# Altium schematic sheet Thermal Camera.SchDoc: Thermal
size A4; SheetSize: A4
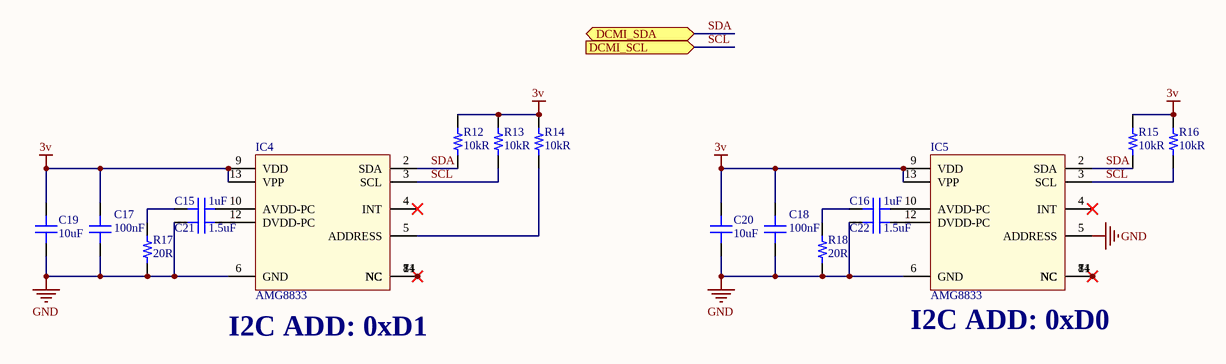
[diagram p0: Thermal Camera.SchDoc]

## Parts
C15  1uF  [CAP 0603/1608]
C16  1uF  [CAP 0603/1608]
C17  100nF  [CAP 0603/1608]
C18  100nF  [CAP 0603/1608]
C19  10uF  [CAP 0603/1608]
C20  10uF  [CAP 0603/1608]
C21  1.5uF  [CAP 0603/1608]
C22  1.5uF  [CAP 0603/1608]
IC4  AMG8833  [PANASONIC AMG8853]
IC5  AMG8833  [PANASONIC AMG8853]
R12  10kR  [RES 0603/1608]
R13  10kR  [RES 0603/1608]
R14  10kR  [RES 0603/1608]
R15  10kR  [RES 0603/1608]
R16  10kR  [RES 0603/1608]
R17  20R  [RES 0603/1608]
R18  20R  [RES 0603/1608]

## Ports
DCMI_SCL (in), DCMI_SDA (bidir)

## Nets
3v: C17.1 C18.1 C19.2 C20.2 IC4.9(VDD) IC4.13(VPP) IC5.9(VDD) IC5.13(VPP) R12.2 R13.2 R14.2 R15.2 R16.2
GND: C17.2 C18.2 C19.1 C20.1 C21.2 C22.2 IC4.6(GND) IC5.5(ADDRESS) IC5.6(GND) R17.1 R18.1
SCL: IC4.3(SCL) IC5.3(SCL) R13.1 R16.1 ; port DCMI_SCL
SDA: IC4.2(SDA) IC5.2(SDA) R12.1 R15.1 ; port DCMI_SDA
NetC15_1: C15.1 R17.2
NetC15_2: C15.2 IC4.10(AVDD-PC)
NetC16_1: C16.1 R18.2
NetC16_2: C16.2 IC5.10(AVDD-PC)
NetC21_1: C21.1 IC4.12(DVDD-PC)
NetC22_1: C22.1 IC5.12(DVDD-PC)
NetIC4_1: IC4.1(NC) IC4.7(NC) IC4.8(NC) IC4.11(NC) IC4.14(NC)
NetIC4_5: IC4.5(ADDRESS) R14.1
NetIC5_1: IC5.1(NC) IC5.7(NC) IC5.8(NC) IC5.11(NC) IC5.14(NC)

Not connected (* = marked no-connect by the designer): IC4 4(INT)*; IC5 4(INT)*

## Notes on the sheet
- (near IC4) I2C ADD: 0xD1
- (near IC5) I2C ADD: 0xD0
- Title:
- Size:
- Project:
- Revision:
- Sheet
- of
- Date:
- YıLDıZ IoT
- Elperek Mahallesi
- Saray Sokak, No:12
- SAKARYA / TURKEY
- File:

## Library data of the parts
C15 C16 = Capacitor - Ceramic: Ceramic, SMT Capacitor; Manufacturer: Samsung; Manufacturer Part Number: CL10A105KP8NNNC; Tolerance: 10%; Voltage Rating: 10V; Dielectric: X5R; Supplier 1: Digi-Key; Supplier Part Number 1: 1276-1182-1-ND; Stock 1: 4590831; Pricing 1: 1 = 0,10000, 10 = 0,03800, 100 = 0,01680, 500 = 0,01200, 1000 = 0,00943 (USD); RoHS: Yes; Mount: Surface Mount; Case/Package: 0603; Case Code (Metric): 1608; Case Code (Imperial): 0603; Contact Plating: Tin; Min Operating Temperature: -55°C; Max Operating Temperature: 85°C; Packaging: Tape and Reel; Package Quantity: 1; Capacitance: 1uF; Voltage: 10V; Length: 1.6mm; Height: 0.8mm; Width: 0.031inch; Thickness: 0.035inch; Depth: 0.8mm; Radiation Hardening: No; ComponentLink1URL: https://datasheet.ciiva.com/15195/getdatasheetpartid-358616-15195708.pdf?src-supplier=Verical; ComponentLink1Description: https://datasheet.ciiva.com/15195/getdatasheetpartid-358616-15195708.pdf?src-supplier=Verical; ComponentLink2URL: https://datasheet.ciiva.com/16358/cl05b104kq5nnnc-16358431.pdf?src-supplier=Future+Electronics; ComponentLink2Description: https://datasheet.ciiva.com/16358/cl05b104kq5nnnc-16358431.pdf?src-supplier=Future+Electronics
C17 C18 = Capacitor - Ceramic: Ceramic, SMT Capacitor; Manufacturer: Samsung; Manufacturer Part Number: CL10B104JB8NNNC; Tolerance: 5%; Voltage Rating: 50V; Dielectric: X7R; Supplier 1: Digi-Key; Supplier Part Number 1: 1276-1033-1-ND; Stock 1: 223594; Pricing 1: 1 = 0,10000, 10 = 0,05300, 100 = 0,02350, 500 = 0,01680, 1000 = 0,01320 (USD); RoHS: Yes; Mount: Surface Mount; Case/Package: 0603; Case Code (Metric): 1608; Case Code (Imperial): 0603; Material: Ceramic; Contact Plating: Tin; Min Operating Temperature: -55°C; Max Operating Temperature: 125°C; Packaging: Tape and Reel; Package Quantity: 1; Capacitance: 100nF; Voltage: 50V; Length: 1.6mm; Height: 0.8mm; Width: 0.031inch; Thickness: 0.035inch; Depth: 0.8mm; Radiation Hardening: No; ComponentLink1URL: https://media.digikey.com/pdf/Data%20Sheets/Samsung%20PDFs/CL_Series_MLCC_ds.pdf?src-supplier=Digi-Key; ComponentLink1Description: https://media.digikey.com/pdf/Data%20Sheets/Samsung%20PDFs/CL_Series_MLCC_ds.pdf?src-supplier=Digi-Key; ComponentLink2URL: https://www.verical.com/server-webapp/html/getDatasheet?partID=359321&src-supplier=Verical; ComponentLink2Description: https://www.verical.com/server-webapp/html/getDatasheet?partID=359321&src-supplier=Verical; ComponentLink3URL: http://www1.futureelectronics.com/doc/SAMSUNG/CL10B104JB8NNNC.pdf?src-supplier=Future+Electronics; ComponentLink3Description: http://www1.futureelectronics.com/doc/SAMSUNG/CL10B104JB8NNNC.pdf?src-supplier=Future+Electronics; ComponentLink4URL: https://produktinfo.conrad.com/datenblaetter/450000-474999/456613-da-01-en-VS_KONDENSATOR_0603.pdf?src-supplier=Conrad; ComponentLink4Description: https://produktinfo.conrad.com/datenblaetter/450000-474999/456613-da-01-en-VS_KONDENSATOR_0603.pdf?src-supplier=Conrad
C19 C20 = Capacitor - Ceramic: Ceramic, SMT Capacitor; Manufacturer: Samsung; Manufacturer Part Number: CL10A106MQ8NNNC; Tolerance: 20%; Voltage Rating: 6.3V; Dielectric: X5R; Supplier 1: Digi-Key; Supplier Part Number 1: 1276-1119-1-ND; Stock 1: 4408315; Pricing 1: 1 = 0,15000, 10 = 0,11000, 100 = 0,05150, 500 = 0,03614, 1000 = 0,02992 (USD); RoHS: Yes; Mount: Surface Mount; Case/Package: 0603; Case Code (Metric): 1608; Case Code (Imperial): 0603; Contact Plating: Tin; Min Operating Temperature: -55°C; Max Operating Temperature: 85°C; Package Quantity: 1; Packaging: Tape and Reel; Capacitance: 10uF; Voltage: 6.3V; Length: 1.6mm; Height: 0.8mm; Width: 0.031inch; Thickness: 0.035inch; Depth: 0.8mm; Radiation Hardening: No; ComponentLink1URL: https://datasheet.ciiva.com/25798/cl10a106mq8nnnc-25798320.pdf?src-supplier=Digi-Key; ComponentLink1Description: https://datasheet.ciiva.com/25798/cl10a106mq8nnnc-25798320.pdf?src-supplier=Digi-Key; ComponentLink2URL: https://datasheet.ciiva.com/26838/getdatasheetpartid-357557-26838347.pdf?src-supplier=Verical; ComponentLink2Description: https://datasheet.ciiva.com/26838/getdatasheetpartid-357557-26838347.pdf?src-supplier=Verical; ComponentLink3URL: https://datasheet.ciiva.com/16437/cl05b104kq5nnnc-16437327.pdf?src-supplier=Future+Electronics; ComponentLink3Description: https://datasheet.ciiva.com/16437/cl05b104kq5nnnc-16437327.pdf?src-supplier=Future+Electronics
C21 C22 = Capacitor - Ceramic: Ceramic, SMT Capacitor; Manufacturer: TDK; Manufacturer Part Number: C1608X7S1C155K080AC; Tolerance: 10%; Voltage Rating: 16V; ComponentLink1URL: https://datasheet.ciiva.com/15195/getdatasheetpartid-358616-15195708.pdf?src-supplier=Verical; ComponentLink1Description: https://datasheet.ciiva.com/15195/getdatasheetpartid-358616-15195708.pdf?src-supplier=Verical; ComponentLink2URL: https://datasheet.ciiva.com/16358/cl05b104kq5nnnc-16358431.pdf?src-supplier=Future+Electronics; ComponentLink2Description: https://datasheet.ciiva.com/16358/cl05b104kq5nnnc-16358431.pdf?src-supplier=Future+Electronics; Supplier 1: Digi-Key; Supplier Part Number 1: 445-174769-1-ND; Stock 1: 2796; Pricing 1: 1 = 0,23000, 10 = 0,15900, 100 = 0,09030, 500 = 0,06376, 1000 = 0,05579 (USD); RoHS: No; Mount: Surface Mount; Case/Package: 0603; Case Code (Imperial): 0603; Case Code (Metric): 1608; Min Operating Temperature: -55°C; Max Operating Temperature: 125°C; Packaging: Tape and Reel; Capacitance: 1.5uF; ComponentLink3URL: https://product.tdk.com/info/en/catalog/spec/mlccspec_commercial_general_midvoltage_en.pdf?src-supplier=Digi-Key; ComponentLink3Description: https://product.tdk.com/info/en/catalog/spec/mlccspec_commercial_general_midvoltage_en.pdf?src-supplier=Digi-Key; ComponentLink4URL: https://product.tdk.com/info/en/catalog/datasheets/mlcc_commercial_general_en.pdf?src-supplier=Digi-Key; ComponentLink4Description: https://product.tdk.com/info/en/catalog/datasheets/mlcc_commercial_general_en.pdf?src-supplier=Digi-Key
IC4 IC5 = Panasonic AMG8833: The Panasonic Electric Works' Grid Eye is a thermopile-type infrared sensor with digital communication. Using advanced MEMS technology, the Grid Eye monitors the quantity of infrared rays for 64 pixels of data. This page describes the internal memory structure that can be accessed through an I2C interface.; Sensing Method: Infrared (IR); Supplier 1: Digi-Key; Supplier Part Number 1: P19002CT-ND; Manufacturer: Panasonic; Manufacturer Part Number: AMG8833; Stock 1: 207; Pricing 1: 1 = 32,50000, 5 = 31,02400, 10 = 28,06900, 25 = 25,85280, 50 = 22,89820 (USD); RoHS: Yes; Case/Package: SMD/SMT; Min Operating Temperature: 0°C; Max Operating Temperature: 80°C; Packaging: Tape and Reel; Output Type: I2C; ComponentLink1URL: https://media.digikey.com/pdf/Data%20Sheets/Panasonic%20Sensors%20PDFs/Grid-EYE_AMG88.pdf?src-supplier=Digi-Key; ComponentLink1Description: https://media.digikey.com/pdf/Data%20Sheets/Panasonic%20Sensors%20PDFs/Grid-EYE_AMG88.pdf?src-supplier=Digi-Key; ComponentLink2URL: http://industrial.panasonic.com/cdbs/www-data/pdf/ADI8000/ADI8000C66.pdf?src-supplier=Newark; ComponentLink2Description: http://industrial.panasonic.com/cdbs/www-data/pdf/ADI8000/ADI8000C66.pdf?src-supplier=Newark; ComponentLink3URL: http://industrial.panasonic.com/cdbs/www-data/pdf/ADI8000/ADI8000C66.pdf?src-supplier=Farnell; ComponentLink3Description: http://industrial.panasonic.com/cdbs/www-data/pdf/ADI8000/ADI8000C66.pdf?src-supplier=Farnell
R12-R16 = Resistor_Chip: Ceramic, SMT Capacitor; Manufacturer: Stackpole Electronics; Manufacturer Part Number: RNCP0603FTD10K0; Tolerance: 1%; Max Power Dissipation: 125mW; Temperature Coefficient: 100ppm/°C; Supplier 1: Digi-Key; Supplier Part Number 1: RNCP0603FTD10K0CT-ND; Stock 1: 183083; Pricing 1: 1 = 0,10000, 10 = 0,06700, 100 = 0,02730, 1000 = 0,01224, 2500 = 0,01063 (USD); RoHS: Yes; Mount: Surface Mount; Case/Package: 0603; Case Code (Metric): 1608; Case Code (Imperial): 0603; Contact Plating: Matte,Tin; Min Operating Temperature: -55°C; Max Operating Temperature: 155°C; Packaging: Tape and Reel; Resistance: 10kR; Composition: Thin Film; Number of Terminations: 2; Features: Anti-Sulfur,Moisture Resistant; Length: 0.059inch; Height: 0.02inch; Width: 0.031inch; Radiation Hardening: No; Lead Free: Lead Free
R17 R18 = Resistor_Chip: Ceramic, SMT Capacitor; Manufacturer: Yageo; Manufacturer Part Number: RC0603JR-0720RL; Voltage Rating (DC): 50V; Temperature Coefficient: 100ppm/°C; Tolerance: 5%; Max Power Dissipation: 100mW; Voltage Rating: 75V; Supplier 1: Digi-Key; Supplier Part Number 1: 311-20GRCT-ND; Stock 1: 99734; Pricing 1: 1 = 0,10000, 10 = 0,01900, 100 = 0,00770, 1000 = 0,00347, 2500 = 0,00301 (USD); RoHS: Yes; Case/Package: 0603; Weight: 7.1E-05oz; Case Code (Imperial): 0603; Case Code (Metric): 1608; Min Operating Temperature: -55°C; Max Operating Temperature: 155°C; Composition: Thick Film; Resistance: 20R; Packaging: Tape and Reel; Termination: SMD/SMT; Number of Terminations: 2; Military Standard: Not; Features: Moisture Resistant; Power Rating: 100mW; Package Quantity: 1; Length: 1.6mm; Height: 0.022inch; Width: 0.8mm; Depth: 0.8mm; Lead Free: Lead Free; REACH SVHC: Unknown; ComponentLink1URL: https://datasheet.ciiva.com/2453/pyu-r-int-thick-7-2453211.pdf?src-supplier=Digi-Key; ComponentLink1Description: https://datasheet.ciiva.com/2453/pyu-r-int-thick-7-2453211.pdf?src-supplier=Digi-Key; ComponentLink2URL: https://datasheet.ciiva.com/2453/pyu-r-int-thick-7-2453212.pdf?src-supplier=Digi-Key; ComponentLink2Description: https://datasheet.ciiva.com/2453/pyu-r-int-thick-7-2453212.pdf?src-supplier=Digi-Key; ComponentLink3URL: https://datasheet.ciiva.com/2453/pyu-r-int-thick-7-2453213.pdf?src-supplier=Digi-Key; ComponentLink3Description: https://datasheet.ciiva.com/2453/pyu-r-int-thick-7-2453213.pdf?src-supplier=Digi-Key